# Altium schematic sheet AD623AR_simple.SchDoc
size A4
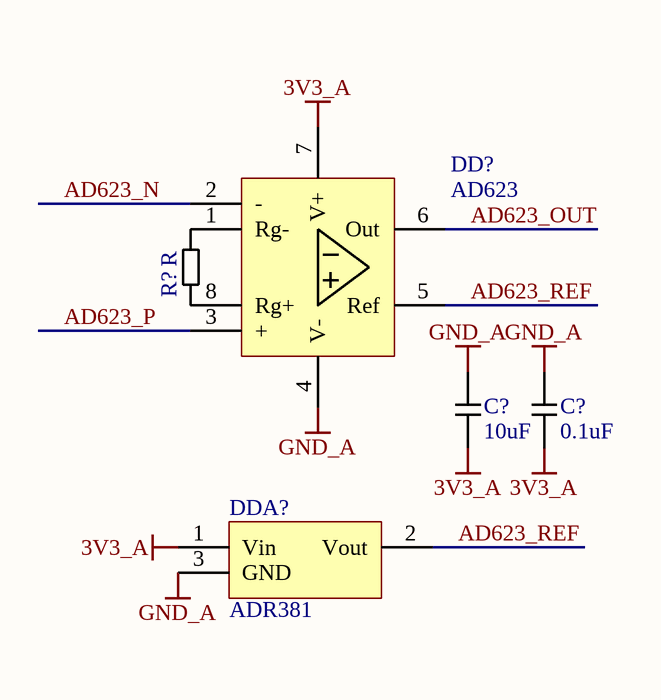
[diagram p0: AD623AR_simple.SchDoc]

## Parts
(Parts that share a designator on the sheet are numbered #1, #2 ... from top to bottom, then left to right.)
C?#1  10uF  [C0603]
C?#2  0.1uF  [C0603]
DD?  AD623  [SO-8]
DDA?  ADR381  [SOT-23-3]
R?  R  [R0603]

## Nets
3V3_A: C?#1.1 C?#2.1 DD?.7(V+) DDA?.1(Vin)
GND_A: C?#1.2 C?#2.2 DD?.4(V-) DDA?.3(GND)
AD623_N: DD?.2(-)
AD623_OUT: DD?.6(Out)
AD623_P: DD?.3(+)
AD623_REF: DD?.5(Ref) DDA?.2(Vout)
NetDD?_1: DD?.1(Rg-) R?.2
NetDD?_8: DD?.8(Rg+) R?.1

## Library data of the parts
C?#1 C?#2 = C: Capacitor
DD? = AD623: Analog Devices Instrumental OpAmp SO-8
DDA? = ADR381: 2.5V Voltage Reference low drift
R? = R: Resistor